# EAGLE schematic transceiver (EAGLE 8.3.0)
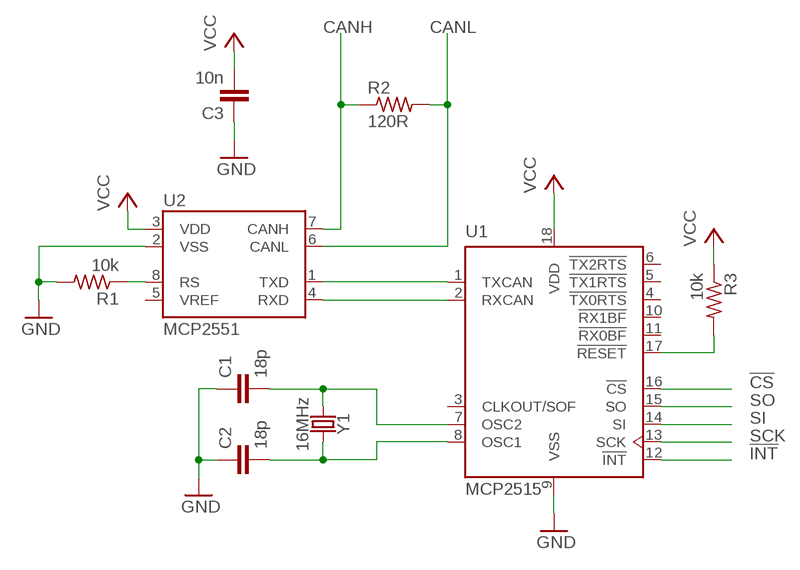
[diagram p0: schematic, sheet 1]

## Parts
C1  18p  C-EU025-030X050  [C025-030X050]
C2  18p  C-EU025-030X050  [C025-030X050]
C3  10n  C-EU025-030X050  [C025-030X050]
R1  10k  R-US_0204/7  [0204/7]
R2  120R  R-US_0204/7  [0204/7]
R3  10k  R-US_0204/7  [0204/7]
U1  MCP2515  [DIL18]
U2  MCP2551  [DIL08]
Y1  16MHz  CRYSTALPTH-HC49UV  [HC49U]

## Nets
!CS: U1.16(!CS)
!INT: U1.12(!INT)
CANH: R2.1 U2.7(CANH)
CANL: R2.2 U2.6(CANL)
GND: C1.1 C2.1 C3.1 R1.2 U1.9(VSS) U2.2(VSS)
N$1: R1.1 U2.8(RS)
N$2: U1.1(TXCAN) U2.1(TXD)
N$3: U1.2(RXCAN) U2.4(RXD)
N$4: C1.2 U1.7(OSC2) Y1.1
N$5: C2.2 U1.8(OSC1) Y1.2
N$7: R3.2 U1.17(!RESET)
SCK: U1.13(SCK)
SI: U1.14(SI)
SO: U1.15(SO)
VCC: C3.2 R3.1 U1.18(VDD) U2.3(VDD)
Unconnected: U1.3(CLKOUT/SOF) U1.4(!TX0RTS) U1.5(!TX1RTS) U1.6(!TX2RTS) U1.10(!RX1BF) U1.11(!RX0BF) U2.5(VREF)

## Library data of the parts
C1-C3 = rcl:C-EU: CAPACITOR, European symbol
R1-R3 = rcl:R-US_: RESISTOR, American symbol
U1 = mcp2515-2551:MCP2515: MCP2515 Stand-Alone CAN Controller with SPI Interface
U2 = mcp2515-2551:MCP2551: MCP2551 High-Speed CAN Transceiver
Y1 = SparkFun-Clocks:CRYSTAL: Crystals (Generic) These are passive quartz crystals, which can be used as a clock source for a microcontroller. Crystal's are two-terminal devices. They require external "load" capacitors to generate an oscillating signal.